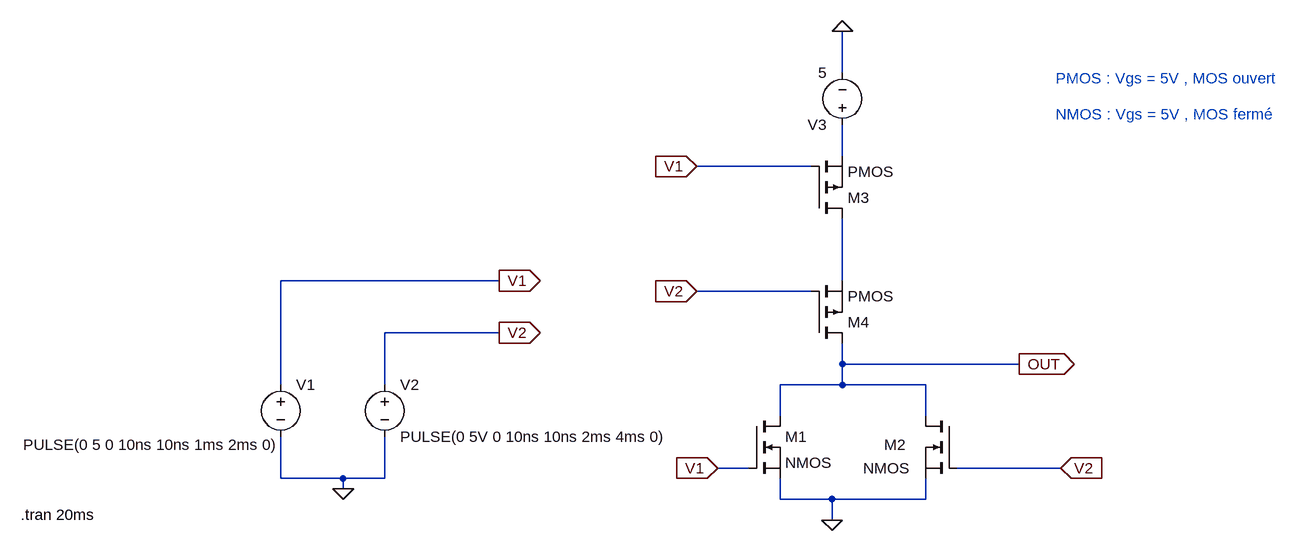
[diagram p0: schematic NOR.asc]
NOR.asc, the LTspice schematic file:
Version 4
SHEET 1 988 804
WIRE 304 -32 304 -96
WIRE 304 96 304 48
WIRE 256 112 80 112
WIRE -224 288 -560 288
WIRE 304 288 304 192
WIRE 256 304 80 304
WIRE -224 368 -400 368
WIRE 304 416 304 384
WIRE 576 416 304 416
WIRE -560 448 -560 288
WIRE -400 448 -400 368
WIRE 304 448 304 416
WIRE 304 448 208 448
WIRE 432 448 304 448
WIRE 208 496 208 448
WIRE 432 496 432 448
WIRE 160 576 112 576
WIRE 640 576 480 576
WIRE -560 592 -560 528
WIRE -464 592 -560 592
WIRE -400 592 -400 528
WIRE -400 592 -464 592
WIRE -464 608 -464 592
WIRE 208 624 208 592
WIRE 288 624 208 624
WIRE 432 624 432 592
WIRE 432 624 288 624
WIRE 288 656 288 624
FLAG -224 288 V1
IOPIN -224 288 Out
FLAG -224 368 V2
IOPIN -224 368 Out
FLAG 80 112 V1
IOPIN 80 112 In
FLAG 80 304 V2
IOPIN 80 304 In
FLAG 112 576 V1
IOPIN 112 576 In
FLAG 640 576 V2
IOPIN 640 576 In
FLAG 576 416 OUT
IOPIN 576 416 Out
FLAG 288 656 0
FLAG 304 -96 0
FLAG -464 608 0
SYMBOL nmos 160 496 R0
SYMATTR InstName M1
SYMBOL nmos 480 496 M0
WINDOW 0 78 44 Left 2
WINDOW 3 72 80 Left 2
SYMATTR InstName M2
SYMBOL pmos 256 192 M180
SYMATTR InstName M3
SYMBOL pmos 256 384 M180
SYMATTR InstName M4
SYMBOL voltage -560 432 R0
WINDOW 3 -396 108 Left 2
WINDOW 123 0 0 Left 0
WINDOW 39 0 0 Left 0
SYMATTR Value PULSE(0 5 0 10ns 10ns 1ms 2ms 0)
SYMATTR InstName V1
SYMBOL voltage -400 432 R0
WINDOW 123 0 0 Left 0
WINDOW 39 0 0 Left 0
SYMATTR InstName V2
SYMATTR Value PULSE(0 5V 0 10ns 10ns 2ms 4ms 0)
SYMBOL voltage 304 64 R180
WINDOW 123 0 0 Left 0
WINDOW 39 0 0 Left 0
SYMATTR InstName V3
SYMATTR Value 5
TEXT -960 648 Left 2 !.tran 20ms
TEXT 632 -24 Left 2 ;PMOS : Vgs = 5V , MOS ouvert
TEXT 632 32 Left 2 ;NMOS : Vgs = 5V , MOS fermé

The netlist it stands for:
* NOR.asc
M1 OUT V1 0 0 NMOS
M2 OUT V2 0 0 NMOS
M3 N002 V1 N001 N001 PMOS
M4 OUT V2 N002 N002 PMOS
V1 V1 0 PULSE(0 5 0 10ns 10ns 1ms 2ms 0)
V2 V2 0 PULSE(0 5V 0 10ns 10ns 2ms 4ms 0)
V3 N001 0 5
.model NMOS NMOS
.model PMOS PMOS
.lib standard.mos
.tran 20ms
* PMOS : Vgs = 5V , MOS ouvert
* NMOS : Vgs = 5V , MOS fermé
.backanno
.end

* Results of the author's LTspice run, read from the files saved beside the schematic
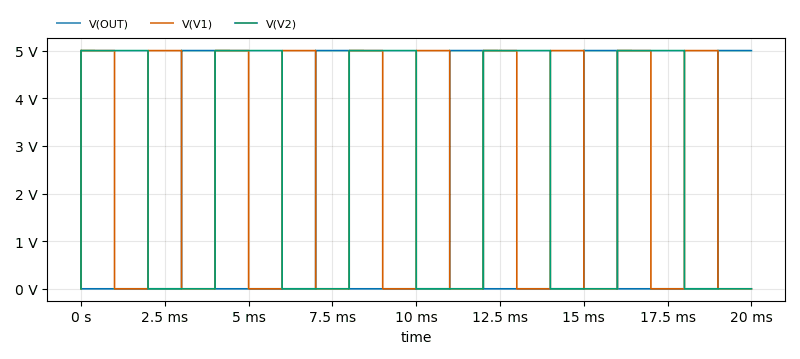
[diagram p1: Transient Analysis of NOR.asc, plotted from the saved traces]
* Transient Analysis, 1 run:
*   V(OUT): min 0 V, max 5.005 V, average 1.25 V, rms 2.5 V, last 5 V
*   V(V1): min 0 V, max 5 V, average 2.5 V, rms 3.536 V, last 0 V
*   V(V2): min 0 V, max 5 V, average 2.5 V, rms 3.536 V, last 0 V